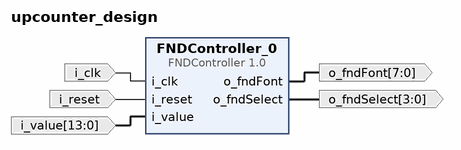
[diagram p0: block diagram of the top level]
# Vivado block design upcounter_design, xc7a35tcpg236-1, Vivado 2020.1
create_bd_design upcounter_design

create_bd_port -dir O -from 3 -to 0 o_fndSelect
create_bd_port -dir I -type clk i_clk
create_bd_port -dir I -type rst i_reset
create_bd_port -dir I -from 13 -to 0 i_value
create_bd_port -dir O -from 7 -to 0 o_fndFont

create_bd_cell -type ip -vlnv xilinx.com:user:FNDController:1.0 FNDController_0

# ---- connections ----

connect_bd_net -net FNDController_o_fndSelect [get_bd_pins FNDController_0/o_fndSelect] [get_bd_ports o_fndSelect]
connect_bd_net -net i_clk_0_1 [get_bd_ports i_clk] [get_bd_pins FNDController_0/i_clk]
connect_bd_net -net i_reset_0_1 [get_bd_ports i_reset] [get_bd_pins FNDController_0/i_reset]
connect_bd_net -net i_value_0_1 [get_bd_ports i_value] [get_bd_pins FNDController_0/i_value]
connect_bd_net [get_bd_pins FNDController_0/o_fndFont] [get_bd_ports o_fndFont]

validate_bd_design
save_bd_design
